# Altium schematic sheet 核心_原理图.SchDoc
size A4
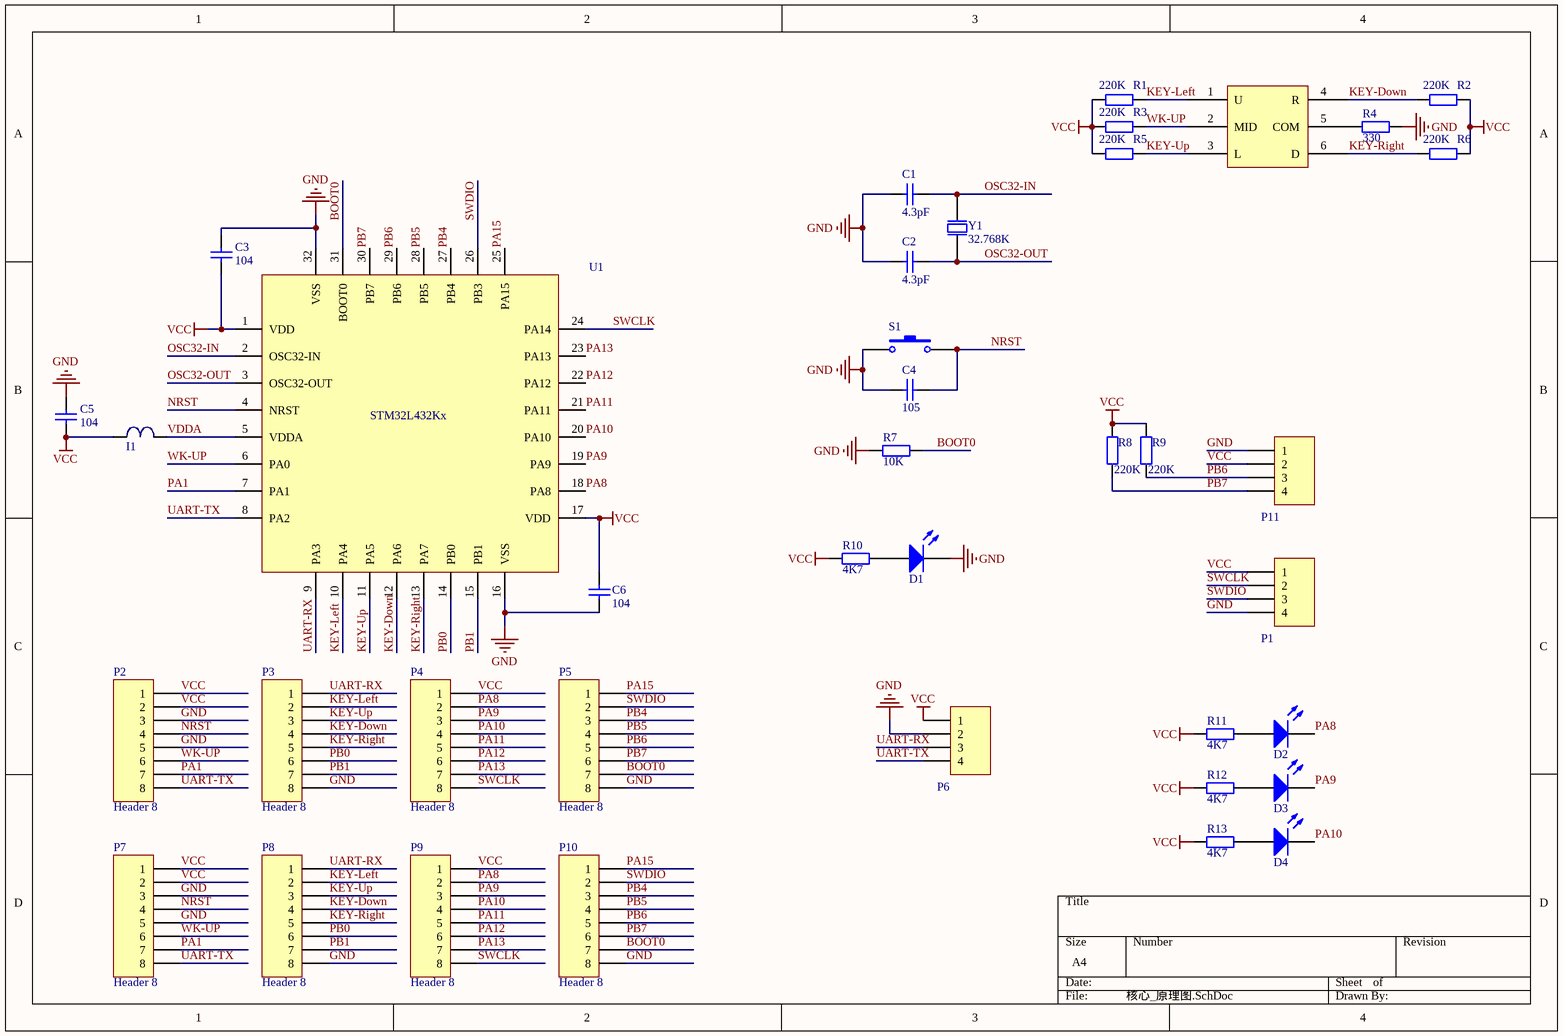
[diagram p0: 核心_原理图.SchDoc]

## Parts
C1  4.3pF  [1__0603-CAP_]
C2  4.3pF  [1__0603-CAP_]
C3  104  [1__0603-CAP_]
C4  105  [1__0603-CAP_]
C5  104  [1__0603-CAP_]
C6  104  [1__0603-CAP_]
D1  LED  [1__0603-LED_]  (value not drawn)
D2  LED  [1__0603-LED_]  (value not drawn)
D3  LED  [1__0603-LED_]  (value not drawn)
D4  LED  [1__0603-LED_]  (value not drawn)
I1  100uH  [1__0603_Ind_]  (value not drawn)
P1  (no value)  [HDR1X4]
P2  Header 8  [HDR1X8]
P3  Header 8  [HDR1X8]
P4  Header 8  [HDR1X8]
P5  Header 8  [HDR1X8]
P6  蓝牙  [HDR1X4]  (value not drawn)
P7  Header 8  [HDR1X8]
P8  Header 8  [HDR1X8]
P9  Header 8  [HDR1X8]
P10  Header 8  [HDR1X8]
P11  (no value)  [HDR1X4]
R1  220K  [1__0603-RES_]
R2  220K  [1__0603-RES_]
R3  220K  [1__0603-RES_]
R4  330  [1__0603-RES_]
R5  220K  [1__0603-RES_]
R6  220K  [1__0603-RES_]
R7  10K  [1__0603-RES_]
R8  220K  [1__0603-RES_]
R9  220K  [1__0603-RES_]
R10  4K7  [1__0603-RES_]
R11  4K7  [1__0603-RES_]
R12  4K7  [1__0603-RES_]
R13  4K7  [1__0603-RES_]
S1  (no value)  [key3*4*2]
U1  STM32L432Kx  [STM32L432]
Y1  32.768K  [OSC32]
五向按键1  五向按键  [1__五向按键_]  (value not drawn)

## Nets
GND: C1.2 C2.2 C3.2 C4.1 C5.2 C6.2 D1.2 P1.4 P2.3 P2.5 P3.8 P5.8 P6.2 P7.3 P7.5 P8.8 P10.8 P11.1 R4.1 R7.2 S1.1 U1.16(VSS) U1.32(VSS)
VCC: C3.1 C5.1 C6.1 I1.1 P1.1 P2.1 P2.2 P4.1 P6.1 P7.1 P7.2 P9.1 P11.2 R1.1 R2.2 R3.1 R5.1 R6.2 R8.2 R9.2 R10.1 R11.1 R12.1 R13.1 U1.1(VDD) U1.17(VDD)
BOOT0: P5.7 P10.7 R7.1 U1.31(BOOT0)
KEY-Down: P3.4 P8.4 R2.1 U1.12(PA6) 五向按键1.4(R)
KEY-Left: P3.2 P8.2 R1.2 U1.10(PA4) 五向按键1.1(U)
KEY-Right: P3.5 P8.5 R6.1 U1.13(PA7) 五向按键1.6(D)
KEY-Up: P3.3 P8.3 R5.2 U1.11(PA5) 五向按键1.3(L)
NRST: C4.2 P2.4 P7.4 S1.2 U1.4(NRST)
OSC32-IN: C1.1 U1.2(OSC32-IN) Y1.2(OSC2)
OSC32-OUT: C2.1 U1.3(OSC32-OUT) Y1.1(OSC1)
PA1: P2.7 P7.7 U1.7(PA1)
PA8: D2.2 P4.2 P9.2 U1.18(PA8)
PA9: D3.2 P4.3 P9.3 U1.19(PA9)
PA10: D4.2 P4.4 P9.4 U1.20(PA10)
PA11: P4.5 P9.5 U1.21(PA11)
PA12: P4.6 P9.6 U1.22(PA12)
PA13: P4.7 P9.7 U1.23(PA13)
PA15: P5.1 P10.1 U1.25(PA15)
PB0: P3.6 P8.6 U1.14(PB0)
PB1: P3.7 P8.7 U1.15(PB1)
PB4: P5.3 P10.3 U1.27(PB4)
PB5: P5.4 P10.4 U1.28(PB5)
PB6: P5.5 P10.5 P11.3 R9.1 U1.29(PB6)
PB7: P5.6 P10.6 P11.4 R8.1 U1.30(PB7)
SWCLK: P1.2 P4.8 P9.8 U1.24(PA14)
SWDIO: P1.3 P5.2 P10.2 U1.26(PB3)
UART-RX: P3.1 P6.3 P8.1 U1.9(PA3)
UART-TX: P2.8 P6.4 P7.8 U1.8(PA2)
VDDA: I1.2 U1.5(VDDA)
WK-UP: P2.6 P7.6 R3.2 U1.6(PA0) 五向按键1.2(MID)
NetD1_1: D1.1 R10.2
NetD2_1: D2.1 R11.2
NetD3_1: D3.1 R12.2
NetD4_1: D4.1 R13.2
NetR4_2: R4.2 五向按键1.5(COM)

## Library data of the parts
C1 C2 = Cap: Capacitor; Value: 105
C3-C6 = Cap: Capacitor
  C3 C5 C6: Value: 104
  C4: Value: 105
D1-D4 = LED0: Typical INFRARED GaAs LED
I1 = 电感: Value: 100uH
P1 P6 P11 = Header 4: Header, 4-Pin
P2-P5 P7-P10 = Header 8: Header, 8-Pin; LatestRevisionDate: 17-Jul-2002; LatestRevisionNote: Re-released for DXP Platform.; Publisher: Altium Limited; Price(RMB): 0.00
R1-R7 = Res2: Resistor; Value: 4K7
R8 R9 = Res2: Resistor; Value: 10K
R10-R13 = Res2: Resistor; Value: 4K7
S1 = SW-PB: Switch
U1 = STM32L432Kx: 单片机
Y1 = XTAL: Crystal Oscillator; Value: 16M